# Altium schematic sheet MCU IO.SchDoc
size B; SheetNumber: 5; SheetTotal: 8
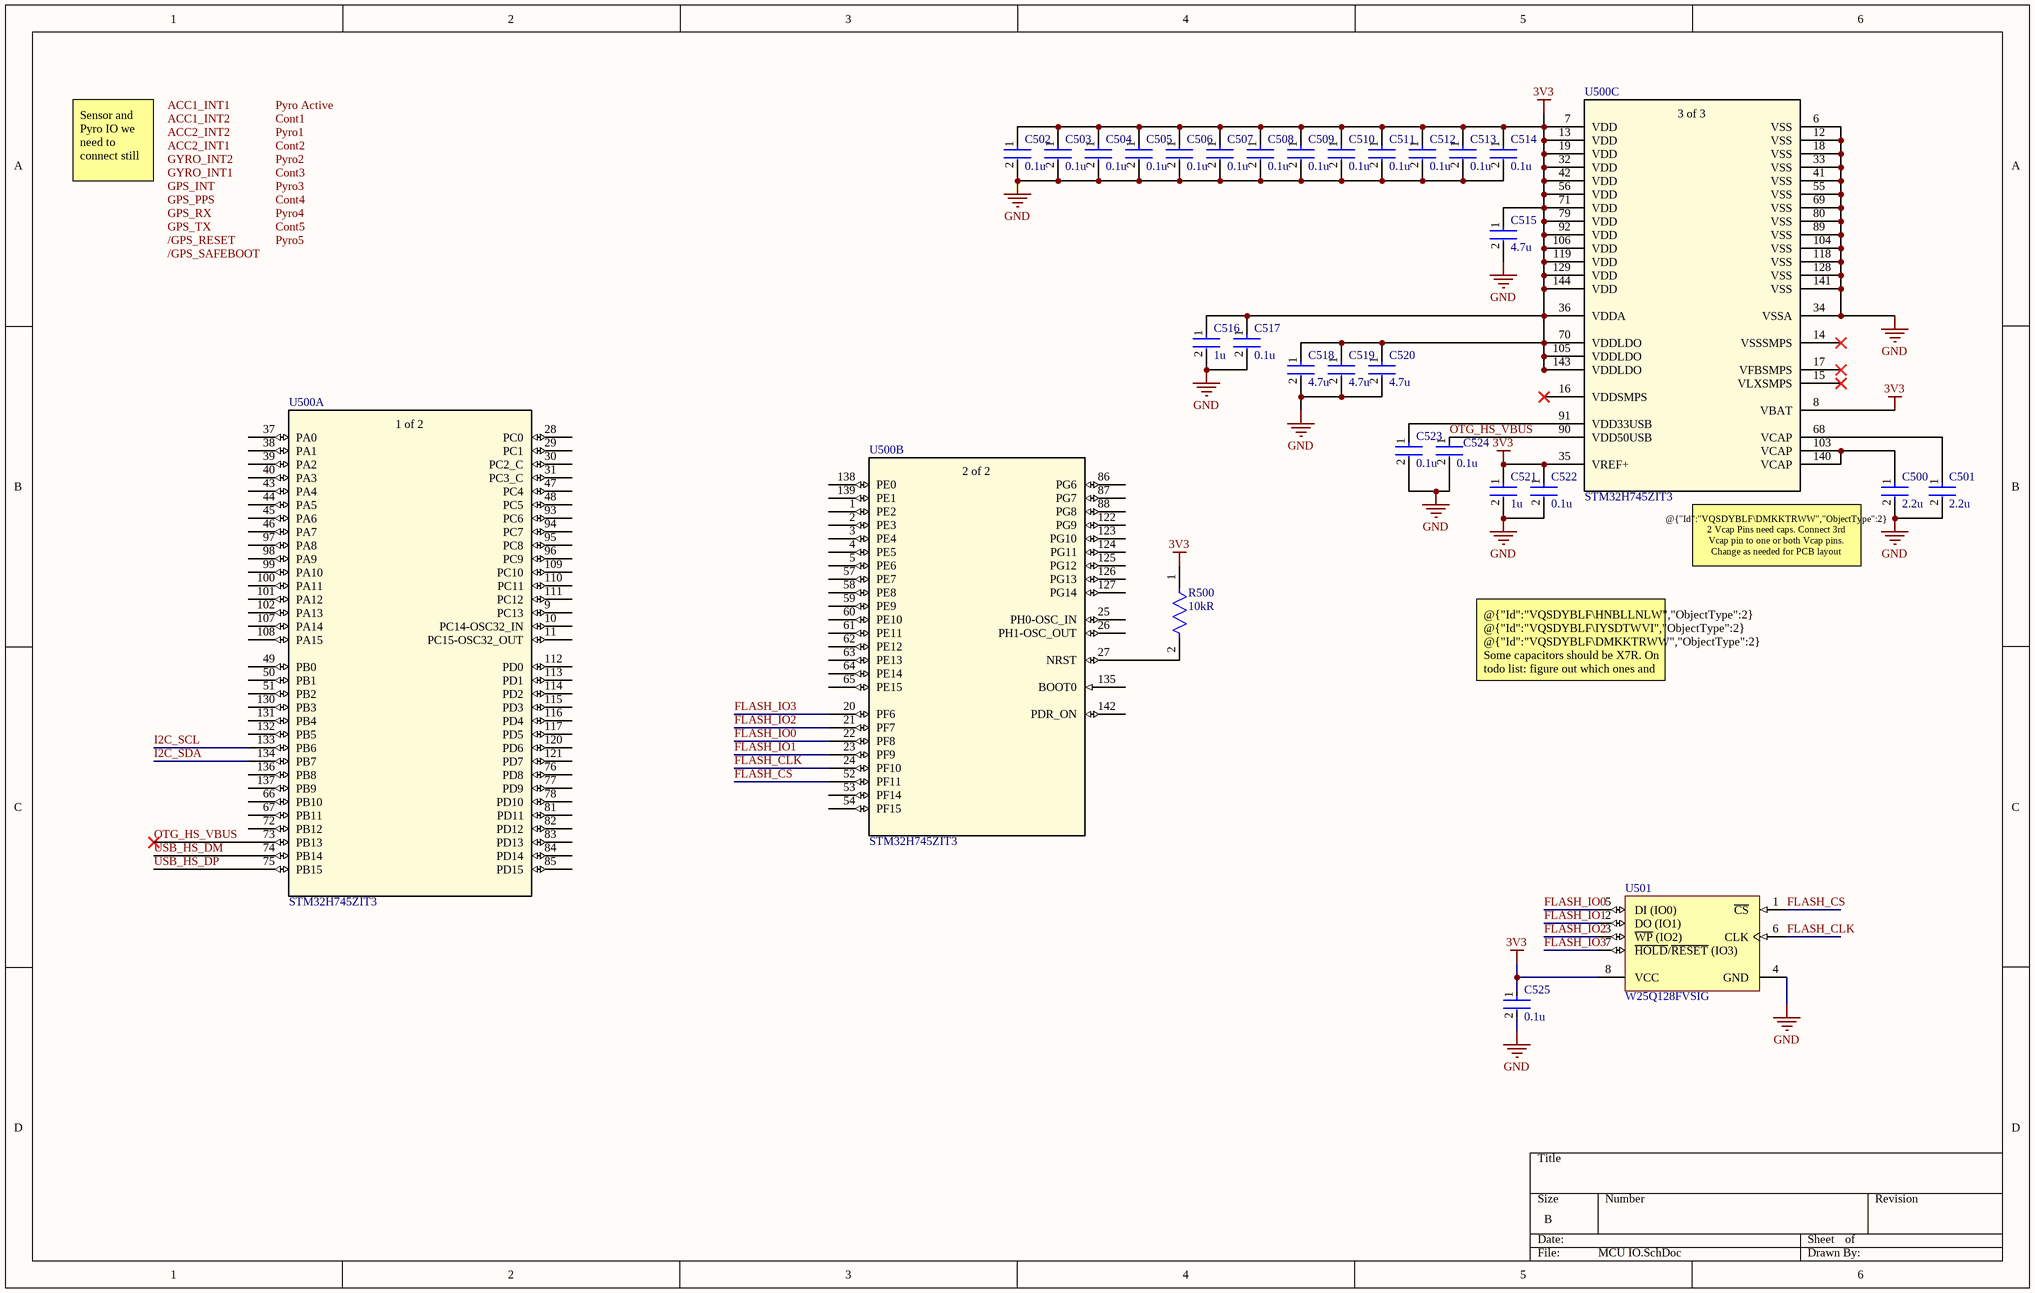
[diagram p0: MCU IO.SchDoc]

## Parts
C500  Capacitance: 2.2u  [FP-CL10-IPC_A]  (hidden comment: CL10C681JB8NFNC)
C501  Capacitance: 2.2u  [FP-CL10-IPC_A]  (hidden comment: CL10C681JB8NFNC)
C502  Capacitance: 0.1u  [FP-CL10-IPC_A]  (hidden comment: CL10C681JB8NFNC)
C503  Capacitance: 0.1u  [FP-CL10-IPC_A]  (hidden comment: CL10C681JB8NFNC)
C504  Capacitance: 0.1u  [FP-CL10-IPC_A]  (hidden comment: CL10C681JB8NFNC)
C505  Capacitance: 0.1u  [FP-CL10-IPC_A]  (hidden comment: CL10C681JB8NFNC)
C506  Capacitance: 0.1u  [FP-CL10-IPC_A]  (hidden comment: CL10C681JB8NFNC)
C507  Capacitance: 0.1u  [FP-CL10-IPC_A]  (hidden comment: CL10C681JB8NFNC)
C508  Capacitance: 0.1u  [FP-CL10-IPC_A]  (hidden comment: CL10C681JB8NFNC)
C509  Capacitance: 0.1u  [FP-CL10-IPC_A]  (hidden comment: CL10C681JB8NFNC)
C510  Capacitance: 0.1u  [FP-CL10-IPC_A]  (hidden comment: CL10C681JB8NFNC)
C511  Capacitance: 0.1u  [FP-CL10-IPC_A]  (hidden comment: CL10C681JB8NFNC)
C512  Capacitance: 0.1u  [FP-CL10-IPC_A]  (hidden comment: CL10C681JB8NFNC)
C513  Capacitance: 0.1u  [FP-CL10-IPC_A]  (hidden comment: CL10C681JB8NFNC)
C514  Capacitance: 0.1u  [FP-CL10-IPC_A]  (hidden comment: CL10C681JB8NFNC)
C515  Capacitance: 4.7u  [FP-CL10-IPC_A]  (hidden comment: CL10C681JB8NFNC)
C516  Capacitance: 1u  [FP-CL10-IPC_A]  (hidden comment: CL10C681JB8NFNC)
C517  Capacitance: 0.1u  [FP-CL10-IPC_A]  (hidden comment: CL10C681JB8NFNC)
C518  Capacitance: 4.7u  [FP-CL10-IPC_A]  (hidden comment: CL10C681JB8NFNC)
C519  Capacitance: 4.7u  [FP-CL10-IPC_A]  (hidden comment: CL10C681JB8NFNC)
C520  Capacitance: 4.7u  [FP-CL10-IPC_A]  (hidden comment: CL10C681JB8NFNC)
C521  Capacitance: 1u  [FP-CL10-IPC_A]  (hidden comment: CL10C681JB8NFNC)
C522  Capacitance: 0.1u  [FP-CL10-IPC_A]  (hidden comment: CL10C681JB8NFNC)
C523  Capacitance: 0.1u  [FP-CL10-IPC_A]  (hidden comment: CL10C681JB8NFNC)
C524  Capacitance: 0.1u  [FP-CL10-IPC_A]  (hidden comment: CL10C681JB8NFNC)
C525  Capacitance: 0.1u  [FP-CL10-IPC_A]  (hidden comment: CL10C681JB8NFNC)
R500  value 10kR  [FP-CPF0603-MFG]  (hidden comment: CPF0603B2K15E1)
U500  STM32H745ZIT3  [LQFP-144]  (parts A,B,C of 3)
U501  W25Q128FVSIG  [WINB-SOIC-8_M]

## Nets
3V3: C502.1 C503.1 C504.1 C505.1 C506.1 C507.1 C508.1 C509.1 C510.1 C511.1 C512.1 C513.1 C514.1 C515.1 C516.1 C517.1 C518.1 C519.1 C520.1 C521.1 C522.1 C525.1 R500.1 U500.7(VDD) U500.8(VBAT) U500.13(VDD) U500.19(VDD) U500.32(VDD) U500.35(VREF+) U500.36(VDDA) U500.42(VDD) U500.56(VDD) U500.70(VDDLDO) U500.71(VDD) U500.79(VDD) U500.92(VDD) U500.105(VDDLDO) U500.106(VDD) U500.119(VDD) U500.129(VDD) U500.143(VDDLDO) U500.144(VDD) U501.8(VCC)
GND: C500.2 C501.2 C502.2 C503.2 C504.2 C505.2 C506.2 C507.2 C508.2 C509.2 C510.2 C511.2 C512.2 C513.2 C514.2 C515.2 C516.2 C517.2 C518.2 C519.2 C520.2 C521.2 C522.2 C523.2 C524.2 C525.2 U500.6(VSS) U500.12(VSS) U500.18(VSS) U500.33(VSS) U500.34(VSSA) U500.41(VSS) U500.55(VSS) U500.69(VSS) U500.80(VSS) U500.89(VSS) U500.104(VSS) U500.118(VSS) U500.128(VSS) U500.141(VSS) U501.4(GND)
FLASH_CLK: U500.24(PF10) U501.6(CLK)
FLASH_CS: U500.52(PF11) U501.1(~{CS})
FLASH_IO0: U500.22(PF8) U501.5(DI_(IO0))
FLASH_IO1: U500.23(PF9) U501.2(DO_(IO1))
FLASH_IO2: U500.21(PF7) U501.3(~{WP}_(IO2))
FLASH_IO3: U500.20(PF6) U501.7(~{HOLD}/~{RESET}_(IO3))
I2C_SCL: U500.133(PB6)
I2C_SDA: U500.134(PB7)
OTG_HS_VBUS: C524.1 U500.73(PB13) U500.90(VDD50USB)
USB_HS_DM: U500.74(PB14)
USB_HS_DP: U500.75(PB15)
NetC500_1: C500.1 U500.103(VCAP) U500.140(VCAP)
NetC501_1: C501.1 U500.68(VCAP)
NetC523_1: C523.1 U500.91(VDD33USB)
NetR500_2: R500.2 U500.27(NRST)

Not connected (* = marked no-connect by the designer): U500 1(PE2) 2(PE3) 3(PE4) 4(PE5) 5(PE6) 9(PC13) 10(PC14-OSC32_IN) 11(PC15-OSC32_OUT) 14(VSSSMPS)* 15(VLXSMPS)* 16(VDDSMPS)* 17(VFBSMPS)* 25(PH0-OSC_IN) 26(PH1-OSC_OUT) 28(PC0) 29(PC1) 30(PC2_C) 31(PC3_C) 37(PA0) 38(PA1) 39(PA2) 40(PA3) 43(PA4) 44(PA5) 45(PA6) 46(PA7) 47(PC4) 48(PC5) 49(PB0) 50(PB1) 51(PB2) 53(PF14) 54(PF15) 57(PE7) 58(PE8) 59(PE9) 60(PE10) 61(PE11) 62(PE12) 63(PE13) 64(PE14) 65(PE15) 66(PB10) 67(PB11) 72(PB12) 76(PD8) 77(PD9) 78(PD10) 81(PD11) 82(PD12) 83(PD13) 84(PD14) 85(PD15) 86(PG6) 87(PG7) 88(PG8) 93(PC6) 94(PC7) 95(PC8) 96(PC9) 97(PA8) 98(PA9) 99(PA10) 100(PA11) 101(PA12) 102(PA13) 107(PA14) 108(PA15) 109(PC10) 110(PC11) 111(PC12) 112(PD0) 113(PD1) 114(PD2) 115(PD3) 116(PD4) 117(PD5) 120(PD6) 121(PD7) 122(PG9) 123(PG10) 124(PG11) 125(PG12) 126(PG13) 127(PG14) 130(PB3) 131(PB4) 132(PB5) 135(BOOT0) 136(PB8) 137(PB9) 138(PE0) 139(PE1) 142(PDR_ON)

## Notes on the sheet
- Sensor and Pyro IO we need to connect still
- @{"Id":"VQSDYBLF\DMKKTRWW","ObjectType":2}
  2 Vcap Pins need caps. Connect 3rd Vcap pin to one or both Vcap pins.
  Change as needed for PCB layout
- @{"Id":"VQSDYBLF\HNBLLNLW","ObjectType":2} @{"Id":"VQSDYBLF\IYSDTWVI","ObjectType":2} @{"Id":"VQSDYBLF\DMKKTRWW","ObjectType":2}
  Some capacitors should be X7R. On todo list: figure out which ones and put parameter on sheet.
- Labels drawn without touching a wire or pin: /GPS_RESET, /GPS_SAFEBOOT, ACC1_INT1, ACC1_INT2, ACC2_INT1, ACC2_INT2, Cont1, Cont2, Cont3, Cont4, Cont5, GPS_INT, GPS_PPS, GPS_RX, GPS_TX, GYRO_INT1, GYRO_INT2, Pyro1, Pyro2, Pyro3, Pyro4, Pyro5, Pyro Active
- (in symbol CMP-028-000001-2, part A) 1 of 2
- (in symbol CMP-028-000001-2, part B) 2 of 2
- (in symbol CMP-028-000001-2, part C) 3 of 3

## Library data of the parts
C500 C501 C515 C516 C518-C521 = CMP-13271-001533-1: Cap Ceramic 680pF 50V C0G ±5% Pad SMD 0603 +125°C T/R; Voltage Rating: 50V; Radiation Hardening: No; Length: 0.063inch; Min Operating Temperature: -55°C; Package Quantity: 1; Lead Free: Lead Free; Case Code (Metric): 1608; Thickness: 0.035inch; Width: 0.031inch; Height: 0.8mm; Case/Package: 0603; Tolerance: 5%; Mount: Surface Mount; Dielectric: C0G; Max Operating Temperature: 125°C; Case Code (Imperial): 0603; Packaging: Tape and Reel; Depth: 0.8mm
C502-C514 C517 C522-C525 = CMP-13271-001533-1: Cap Ceramic 680pF 50V C0G ±5% Pad SMD 0603 +125°C T/R; Dielectric: X7R; Voltage Rating: 50V; Radiation Hardening: No; Length: 0.063inch; Min Operating Temperature: -55°C; Package Quantity: 1; Lead Free: Lead Free; Case Code (Metric): 1608; Thickness: 0.035inch; Width: 0.031inch; Height: 0.8mm; Case/Package: 0603; Tolerance: 5%; Mount: Surface Mount; Max Operating Temperature: 125°C; Case Code (Imperial): 0603; Packaging: Tape and Reel; Depth: 0.8mm
R500 = CMP-03211-008657-1: RES SMD 2.15KΩ 0.1% 1/16W 0603; Manufacturer: TE Connectivity; Temperature Coefficient: 25ppm/°C; Voltage Rating: 50V; Power Rating: 0.063W; Height: 0.55mm; Series: CPF; ComponentLink2Description: Datasheet; Package: CPF0603; Automotive: No; octopart_url: https://octopart.com/cpf0603b2k15e1-te+connectivity-22739551; Lead Free: Yes; Temperature: -55°C to +155°C; RoHS: TRUE; Ipc Land Pattern Name: RESC15580X45; Temperature Range Low: -55°C; Composition: Thin Film; Device Class L3: Chip SMD Resistors; Category: Res; Octopart: https://octopart.com/cpf0603b2k15e1-te+connectivity-22739551; Resistance: 2.15KΩ; ComponentLink2URL: https://www.te.com/commerce/DocumentDelivery/DDEController?Action=showdoc&DocId=Data+Sheet%7F1773200%7FM%7Fpdf%7FEnglish%7FENG_DS_1773200_M.pdf%7F3-1676481-2; Manufacturer Part Number: CPF0603B2K15E1; packaging: 1k Reel; Tolerance: 0.1%; Temperature Range High: +155°C; Device Class L1: Passive Components; Device Class L2: Resistors
U500 = CMP-028-000001-2: 32-bit Dual Core, 144 Pin, 97 IO, 1M RAM, 2M Flash; Mfr_Name: STMicroelectronics; RefDes: RefDes; Design Item ID: STM32H745ZIT3; Type: Type; RoHS Compliant: Yes; Source: STM32H745ZIT3.SchLib; PartId: 1
U501 = CMP-2000-05005-1: 3V 128M-Bit Serial Flash Memory with Dual/Quad SPI & QPI, 2.7 to 3.6 V, -40 to 85 degC, 8-Pin SOIC, RoHS, Tape and Reel; Manufacturer: Winbond; Number of Words: 16777216; Address Bus: 24b; Word Size: 8b; Boot Type: NotRequired; Supply Current: 20mA; Operating Supply Voltage (Max): 3.6V; Sync/Async: Synchronous; Rad Hardened: No; Interface Type: Serial(SPI); Access Time (Max): 7ns; Operating Supply Voltage (Min): 2.7V; Operating Supply Voltage (Typ): 3/3.3V; Programmable: Yes; Density: 134217728Bit; Cell Type: NOR; Package Description: 8-Pin Small Outline Integrated Circuit, Body 5.28 x 5.28 mm, Pitch 1.27 mm; Datasheet URL: http://download.siliconexpert.com/pdfs/2015/11/30/6/42/17/890/win_/manual/3w25q128fv20rev.l2008242015.pdf; Package Reference: SS-8; Package Type: SOICW; Datasheet Version: Rev. L, 08/2015; Manufacturer URL: http://www.winbond.com/hq/index.html?__locale=en; Pin Count: 8; Operating Temperature Classification: Industrial; Operating Temperature (Min): -40C; Program/Erase Volt (Typ): 2.7to3.6V; Operating Temperature (Max): 85C; Mounting: SurfaceMount; Operating Temp Range: -40Cto85C